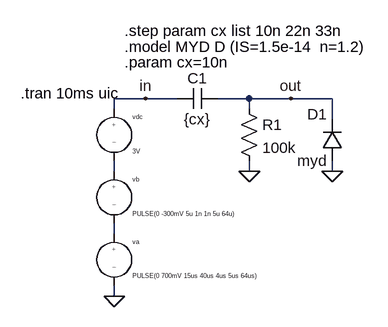
[diagram p0: schematic clamp.asc]
clamp.asc, the LTspice schematic file:
Version 4
SHEET 1 880 680
WIRE 128 0 80 0
WIRE 176 0 128 0
WIRE 288 0 240 0
WIRE 352 0 288 0
WIRE 416 0 352 0
WIRE 80 16 80 0
WIRE 288 16 288 0
WIRE 416 32 416 0
WIRE 80 112 80 96
WIRE 288 112 288 96
WIRE 416 112 416 96
WIRE 80 208 80 192
WIRE 80 304 80 288
FLAG 80 304 0
FLAG 128 0 in
FLAG 288 112 0
FLAG 416 112 0
FLAG 352 0 out
SYMBOL source-V 80 96 R0
WINDOW 123 0 0 Left 2
WINDOW 39 0 0 Left 2
SYMATTR InstName vb
SYMATTR Value PULSE(0 -300mV 5u 1n 1n 5u 64u)
SYMBOL source-V 80 192 R0
WINDOW 123 0 0 Left 2
WINDOW 39 0 0 Left 2
SYMATTR InstName va
SYMATTR Value PULSE(0 700mV 15us 40us 4us 5us 64us)
SYMBOL source-V 80 0 R0
SYMATTR InstName vdc
SYMATTR Value 3V
SYMBOL cap 176 16 R270
WINDOW 0 32 32 VTop 2
WINDOW 3 0 32 VBottom 2
SYMATTR InstName C1
SYMATTR Value {cx}
SYMBOL res 272 0 R0
SYMATTR InstName R1
SYMATTR Value 100k
SYMBOL diode 432 96 R180
WINDOW 0 24 72 Left 2
WINDOW 3 24 0 Left 2
SYMATTR InstName D1
SYMATTR Value myd
TEXT -64 -8 Left 2 !.tran 10ms uic
TEXT 96 -80 Left 2 !.model MYD D (IS=1.5e-14  n=1.2)
TEXT 96 -56 Left 2 !.param cx=10n
TEXT 96 -104 Left 2 !.step param cx list 10n 22n 33n

The netlist it stands for:
* clamp.asc
vb N001 N002 PULSE(0 -300mV 5u 1n 1n 5u 64u)
va N002 0 PULSE(0 700mV 15us 40us 4us 5us 64us)
vdc in N001 3V
C1 in out {cx}
R1 out 0 100k
D1 0 out myd
.model D D
.lib standard.dio
.tran 10ms uic
.model MYD D (IS=1.5e-14  n=1.2)
.param cx=10n
.step param cx list 10n 22n 33n
.backanno
.end